# EAGLE design Viltrox L132T SAMD Upgrade (EAGLE 9.6.2)
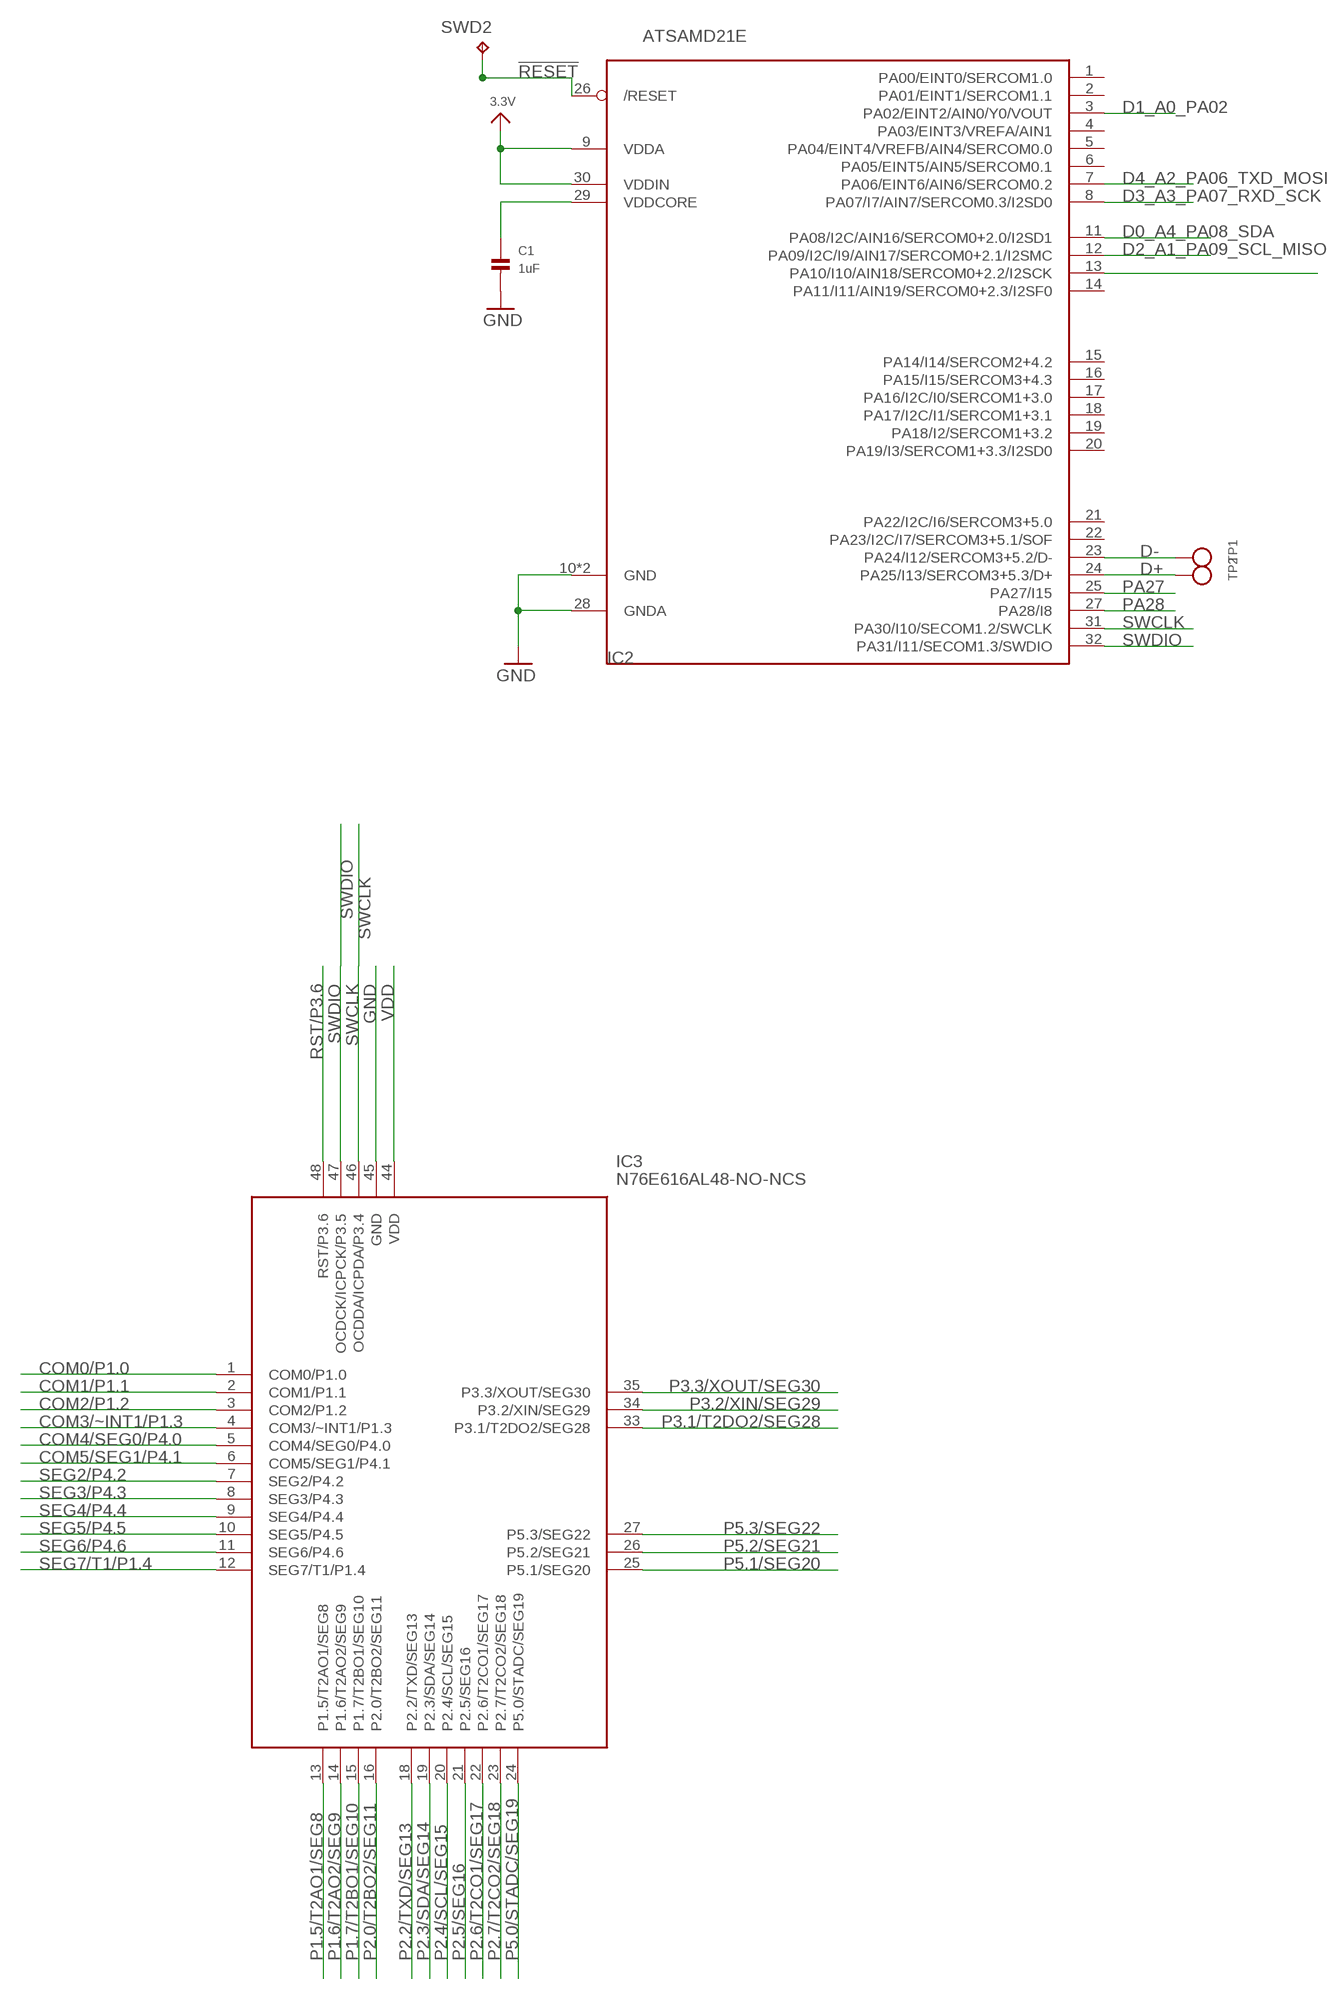
[diagram p0: schematic, sheet 1]

## Parts
C1  1uF  CAP_CERAMIC_0402MP  [_0402MP]
IC2  ATSAMD21E  [QFN32_5MM]
IC3  N76E616AL48-NO-NCS  [N76-NO-NC-QFP50P900X900X160-48N]
SWD2  TPB1,27  [B1,27]
TP1  TESTPOINTROUND2MM  [TESTPOINT_ROUND_2MM]
TP2  TESTPOINTROUND2MM  [TESTPOINT_ROUND_2MM]

## Nets
3.3V: IC2.9(VDDA) IC2.30(VDDIN)
!RESET: IC2.26(/RESET) SWD2.TP
COM0/P1.0: IC3.1(COM0/P1.0)
COM1/P1.1: IC3.2(COM1/P1.1)
COM2/P1.2: IC3.3(COM2/P1.2)
COM3/~INT1/P1.3: IC3.4(COM3/~INT1/P1.3)
COM4/SEG0/P4.0: IC3.5(COM4/SEG0/P4.0)
COM5/SEG1/P4.1: IC3.6(COM5/SEG1/P4.1)
D0_A4_PA08_SDA: IC2.11(PA08/I2C/AIN16/SERCOM0+2.0/I2SD1)
D1_A0_PA02: IC2.3(PA02/EINT2/AIN0/Y0/VOUT)
D2_A1_PA09_SCL_MISO: IC2.12(PA09/I2C/I9/AIN17/SERCOM0+2.1/I2SMC)
D3_A3_PA07_RXD_SCK: IC2.8(PA07/I7/AIN7/SERCOM0.3/I2SD0)
D4_A2_PA06_TXD_MOSI: IC2.7(PA06/EINT6/AIN6/SERCOM0.2)
D+: IC2.24(PA25/I13/SERCOM3+5.3/D+) TP2.P$1
D-: IC2.23(PA24/I12/SERCOM3+5.2/D-) TP1.P$1
GND: C1.2 IC2.10(GND) IC2.28(GNDA) IC2.33(GND) IC3.45(GND)
N$11: IC2.13(PA10/I10/AIN18/SERCOM0+2.2/I2SCK)
P1.5/T2AO1/SEG8: IC3.13(P1.5/T2AO1/SEG8)
P1.6/T2AO2/SEG9: IC3.14(P1.6/T2AO2/SEG9)
P1.7/T2BO1/SEG10: IC3.15(P1.7/T2BO1/SEG10)
P2.0/T2BO2/SEG11: IC3.16(P2.0/T2BO2/SEG11)
P2.2/TXD/SEG13: IC3.18(P2.2/TXD/SEG13)
P2.3/SDA/SEG14: IC3.19(P2.3/SDA/SEG14)
P2.4/SCL/SEG15: IC3.20(P2.4/SCL/SEG15)
P2.5/SEG16: IC3.21(P2.5/SEG16)
P2.6/T2CO1/SEG17: IC3.22(P2.6/T2CO1/SEG17)
P2.7/T2CO2/SEG18: IC3.23(P2.7/T2CO2/SEG18)
P3.1/T2DO2/SEG28: IC3.33(P3.1/T2DO2/SEG28)
P3.2/XIN/SEG29: IC3.34(P3.2/XIN/SEG29)
P3.3/XOUT/SEG30: IC3.35(P3.3/XOUT/SEG30)
P5.0/STADC/SEG19: IC3.24(P5.0/STADC/SEG19)
P5.1/SEG20: IC3.25(P5.1/SEG20)
P5.2/SEG21: IC3.26(P5.2/SEG21)
P5.3/SEG22: IC3.27(P5.3/SEG22)
PA27: IC2.25(PA27/I15)
PA28: IC2.27(PA28/I8)
RST/P3.6: IC3.48(RST/P3.6)
SEG2/P4.2: IC3.7(SEG2/P4.2)
SEG3/P4.3: IC3.8(SEG3/P4.3)
SEG4/P4.4: IC3.9(SEG4/P4.4)
SEG5/P4.5: IC3.10(SEG5/P4.5)
SEG6/P4.6: IC3.11(SEG6/P4.6)
SEG7/T1/P1.4: IC3.12(SEG7/T1/P1.4)
SWCLK: IC2.31(PA30/I10/SECOM1.2/SWCLK) IC3.46(OCDDA/ICPDA/P3.4)
SWDIO: IC2.32(PA31/I11/SECOM1.3/SWDIO) IC3.47(OCDCK/ICPCK/P3.5)
VDD: IC3.44(VDD)
VDDCORE1: C1.1 IC2.29(VDDCORE)
Unconnected: IC2.1(PA00/EINT0/SERCOM1.0) IC2.2(PA01/EINT1/SERCOM1.1) IC2.4(PA03/EINT3/VREFA/AIN1) IC2.5(PA04/EINT4/VREFB/AIN4/SERCOM0.0) IC2.6(PA05/EINT5/AIN5/SERCOM0.1) IC2.14(PA11/I11/AIN19/SERCOM0+2.3/I2SF0) IC2.15(PA14/I14/SERCOM2+4.2) IC2.16(PA15/I15/SERCOM3+4.3) IC2.17(PA16/I2C/I0/SERCOM1+3.0) IC2.18(PA17/I2C/I1/SERCOM1+3.1) IC2.19(PA18/I2/SERCOM1+3.2) IC2.20(PA19/I3/SERCOM1+3.3/I2SD0) IC2.21(PA22/I2C/I6/SERCOM3+5.0) IC2.22(PA23/I2C/I7/SERCOM3+5.1/SOF)

## Library data of the parts
C1 = microbuilder:CAP_CERAMIC: Ceramic Capacitors 0402 - 0402 Surface Mount Capacitors 16pF 50V 5% [Digikey: 445-4899-2-ND] 18pF 50V 5% [Digikey: 490-1281-2-ND] 22pF 50V 5% [Digikey: 490-1283-2-ND] 68pF 50V 5% [Digikey: 490-1289-2-ND] 0.1uF 10V 10% [Digikey: 490-1318-2-ND] 1.0uF 6.3V 10% [Digikey: 490-1320-2-ND] 0603 - 0603 Surface Mount Capacitors 16 pF 50V 5% [Digikey: 445-5051-2-ND] 22 pF 50V [Digikey: PCC220ACVTR-ND] 33 pF 50V 5% [Digikey: 490-1415-1-ND] 56pF 50V 5% [Digikey: 490-1421-1-ND] 220pF 50V 5% [Digikey: 445-1285-1-ND] 680 pF 50V 2200 pF 50V 5% C0G [Digikey: 445-1297-1-ND] 5600 pF 100V 5% X7R [Digikey: 478-3711-1-ND] 0.1 µF 25V 10% [Digikey: PCC2277TR-ND] 0.22 µF 16V 10% X7R [Digikey: 445-1318-1-ND] 1.0 µF 25V 10% [Digikey: 445-5146-2-ND] 0603 - RF Specific 3pF 250V +/-0.1pF RF [Digikey: 712-1347-1-ND] 18 pF 250V 5% [Digikey: 478-3505-1-ND or 712-1322-1-ND] 56 pF 250V 5% C0G RF [Digikey: 490-4867-1-ND] 68 pF 250V RF [Digikey: 490-4868-1-ND] 0805 - 0805 Surface Mount Capacitors 220 pF 250V 2% RF Ceramic Capacitor [Digikey: 712-1398-1-ND] 1000 pF 50V 2% NP0 Ceramic Capacitor [Digikey: 478-3760-1-ND] 0.1 µF 25V 10% Ceramic Capacitor [Digikey: PCC1828TR-ND] 1.0 µF 16V 10% Ceramic Capacitor[Digikey: 490-1691-2-ND] 10.0 µF 10V 10% Ceramic Capacitor[Digikey: 709-1228-1-ND] 10.0 uF 16V 10% Ceramic Capacitor [Digikey: 478-5165-2-ND] 47 uF 6.3V 20% Ceramic Capacitor [Digikey: 587-1779-1-ND or 399-5506-1-ND] 1206 - 1206 Surface Mount Capacitors 47uF 10V 20% Ceramic Capacitor [Digikey: 490-5528-1-ND or 399-5508-1-ND or 445-6010-1-ND] 100uF 6.3V -20%, +80% Y5V Ceramic Capacitor (Digikey: 490-4512-1-ND, Mouser: 81-GRM31CF50J107ZE1L)
IC2 = microbuilder:ATSAMD21E
IC3 = SamacSys_Parts:N76E616AL48-NO-NCS: IC MCU 8BIT 18KB FLASH 48LQFP Source: Datasheet <http://www.nuvoton.com/hq/resource-download.jsp?tp_GUID=DA00-N76E616>
SWD2 = testpad:TP: Test pad
TP1 TP2 = microbuilder:TESTPOINT: Test Point Various test points for characterisation and PCB testing TESTPOINT_SMT - Compact Surface Mount Test Point [Digikey: 5016KTR-ND]

## Board
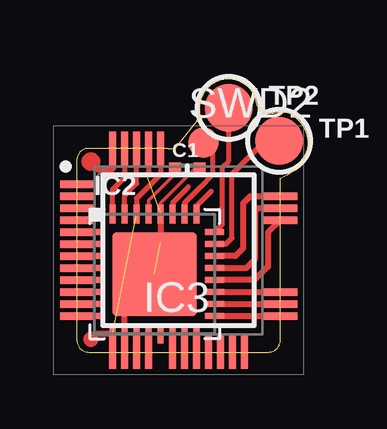
[diagram p1: board, top side]

Size 9.66 x 11.38 mm. Coordinates in mm from the lower left corner, seen from the top.
Outline: 3.8,8.5 0.51,8.5 arc90 0,7.99 0,0.51 arc90 0.51,0 7.99,0 arc90 8.5,0.51 8.5,6.3 8.5,7.26 8.52,7.27 arc28 9.33,7.84 arc83 9.33,9.59 arc76 8.21,9.95 arc-103 7.49,10.56 arc148 5.14,10.43 5.14,9.8 4.61,9.11 4.1,8.5 3.8,8.5
Copper layers (1*16): Top 0.035mm / dielectric 1.5mm / Bottom 0.035mm
Design rules "OthermillDRC_30_deg_v2 *": minimum track width 4mil, minimum drill 0.8mm, track to track 4mil, track to pad 4mil, pad to pad 4mil, via to via 4mil, smd to smd 0mil, copper to edge 0mil, drill to drill 4mil, minimum pad ring 10mil, minimum via ring 10mil, stop-mask expansion 1mil, vias tented up to drill 30mil, thermal gap 6mil

### Footprints (pad centres in the part's own frame; a part is rotated, then mirrored left to right if it is on the bottom)
_0402MP = smd 0.5 x 0.5: 1 -0.508,0; 2 0.508,0
QFN32_5MM = smd 0.8 x 0.25: 1 -2.5,1.75; 2 -2.5,1.25; 3 -2.5,0.75; 4 -2.5,0.25; 5 -2.5,-0.25; 6 -2.5,-0.75; 7 -2.5,-1.25; 8 -2.5,-1.75; 17 2.5,-1.75; 18 2.5,-1.25; 19 2.5,-0.75; 20 2.5,-0.25; 21 2.5,0.25; 22 2.5,0.75; 23 2.5,1.25; 24 2.5,1.75 | smd 0.25 x 0.8: 9 -1.75,-2.5; 10 -1.25,-2.5; 11 -0.75,-2.5; 12 -0.25,-2.5; 13 0.25,-2.5; 14 0.75,-2.5; 15 1.25,-2.5; 16 1.75,-2.5; 25 1.75,2.5; 26 1.25,2.5; 27 0.75,2.5; 28 0.25,2.5; 29 -0.25,2.5; 30 -0.75,2.5; 31 -1.25,2.5; 32 -1.75,2.5 | smd 3.5 x 3.5: 33 0,0
N76-NO-NC-QFP50P900X900X160-48N = smd 1.45 x 0.3: 1 -4.225,2.75; 2 -4.225,2.25; 3 -4.225,1.75; 4 -4.225,1.25; 5 -4.225,0.75; 6 -4.225,0.25; 7 -4.225,-0.25; 8 -4.225,-0.75; 9 -4.225,-1.25; 10 -4.225,-1.75; 11 -4.225,-2.25; 12 -4.225,-2.75; 25 4.225,-2.75; 26 4.225,-2.25; 27 4.225,-1.75; 33 4.225,1.25; 34 4.225,1.75; 35 4.225,2.25 | smd 0.3 x 1.45: 13 -2.75,-4.225; 14 -2.25,-4.225; 15 -1.75,-4.225; 16 -1.25,-4.225; 18 -0.25,-4.225; 19 0.25,-4.225; 20 0.75,-4.225; 21 1.25,-4.225; 22 1.75,-4.225; 23 2.25,-4.225; 24 2.75,-4.225; 44 -0.75,4.225; 45 -1.25,4.225; 46 -1.75,4.225; 47 -2.25,4.225; 48 -2.75,4.225
B1,27 = smd 1.27 x 1.27: TP 0,0
TESTPOINT_ROUND_2MM = smd 2 x 2: P$1 0,0

### Placement (x,y rotation side)
C1  4.61,7.65 0 top
IC2  3.25,3.25 0 top
IC3  4.25,4.25 0 top
SWD2  5.29,8.75 0 top
TP1  8.44,8.82 0 top
TP2  6.35,10.19 0 top

### Tracks (layer width: path | path; a pad name or v marks a point on that pad's centre or on a via)
3.3V  (1 unrouted)
  Top 0.254: IC2.9 0.81,0.75 0.59,0.54
  Top 0.635: 0.59,0.54 0.59,0.52
!RESET
  Top 0.203: IC2.26 4.5,6.23 5.14,6.87 5.67,7.4 5.67,8.37 SWD2.TP
D+
  Top 0.203: IC2.24 6.06,5.32 6.06,7.69 6.35,7.97 TP2.P$1
D-
  Top 0.152: 7.88,8.82 TP1.P$1
  Top 0.203: IC2.23 6.23,4.51 6.49,4.76 6.49,7.43 7.88,8.82
GND  (3 unrouted)
  Top 0.152: C1.2 4.94,7.65 3.5,6.22 IC2.28 | 3.2,3.26 IC2.33 | 3.25,3.28 2,2.02
  Top 0.203: IC3.45 3,7.5 2.9,7.4
  Top 0.254: IC2.28 3.5,4.54 | IC2.10 2,2.02
P3.1/T2DO2/SEG28
  Top 0.254: IC3.33 7.98,5.01 7.98,3.56 7.42,3 5.91,3
P3.2/XIN/SEG29
  Top 0.254: IC3.34 7.55,6 7.43,5.88 7.43,3.87 7.05,3.5 5.86,3.5
P3.3/XOUT/SEG30
  Top 0.254: IC3.35 7.24,6.5 6.94,6.21 6.94,4.33 6.62,4 6.05,4
P5.1/SEG20
  Top 0.254: IC3.25 6.01,1.5 6,1.51
P5.2/SEG21
  Top 0.254: IC3.26 6,2 5.99,1.99
P5.3/SEG22
  Top 0.254: IC3.27 5.97,2.5
PA27
  Top 0.152: IC2.25 5,6.09
  Top 0.203: 5,6.09 5.62,6.71
PA28
  Top 0.203: IC2.27 4,6.16 4.01,6.17 4.01,6.25 4.66,6.89
RST/P3.6
  Top 0.305: IC3.48 1.5,7.7 1.43,7.63 0.92,7.63 0.59,7.96
  Top 0.762: 0.59,7.96 0.58,7.95
SWCLK
  Top 0.203: IC2.31 2,6.52 2.5,7.02 IC3.46
SWDIO
  Top 0.203: IC2.32 1.5,6.78 2.02,7.3 2.02,8.46 IC3.47
VDD
  Top 0.203: IC3.44 3.5,7.41 2.5,6.41 2.5,5.7
VDDCORE1
  Top 0.152: IC2.29 3,6.33 4.1,7.43 C1.1